# EAGLE design TinyTX_boost_converter (EAGLE 6.5.0)
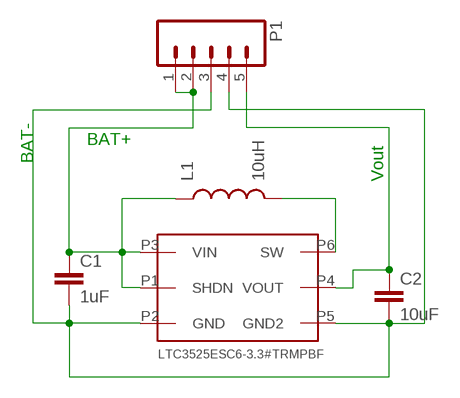
[diagram p0: schematic, sheet 1]

## Parts
C1  1uF  1.0UF-16V-10%(0603)  [0603-CAP]
C2  10uF  10UF-6.3V-20%(0603)  [0603-CAP]
L1  10uH  INDUCTOR1210  [1210]
P1  M05PTH  [1X05]
U1  LTC3525  [6-LEAD-SC70]

## Nets
GND: C1.2 C2.2 P1.3 P1.4 U1.P2(GND) U1.P5(GND2)
P6: L1.2 U1.P6(SW)
VCC: C2.1 P1.5 U1.P4(VOUT)
VIN: C1.1 L1.1 P1.1 P1.2 U1.P1(SHDN) U1.P3(VIN)

## Notes on the sheet
- BAT+ | Vout
- BAT-
- LTC3525ESC6-3.3#TRMPBF

## Library data of the parts
C1 = SparkFun-Capacitors:1.0UF-16V-10%(0603): CAP-00868; PROD_ID: CAP-00868; VALUE: 1.0uF
C2 = SparkFun-Capacitors:10UF-6.3V-20%(0603): CAP-11015; PROD_ID: CAP-11015
L1 = SparkFun:INDUCTOR: Inductors Basic Inductor/Choke - 0603 and 1206. Footprints are not proven and vary greatly between part numbers.
P1 = SparkFun:M05: Header 5 Standard 5-pin 0.1" header. Use with straight break away headers (SKU : PRT-00116), right angle break away headers (PRT-00553), swiss pins (PRT-00743), machine pins (PRT-00117), and female headers (PRT-00115). Molex polarized connector foot print use with SKU : PRT-08230 with associated crimp pins and housings.
U1 = TSlib:LTC3525

## Board
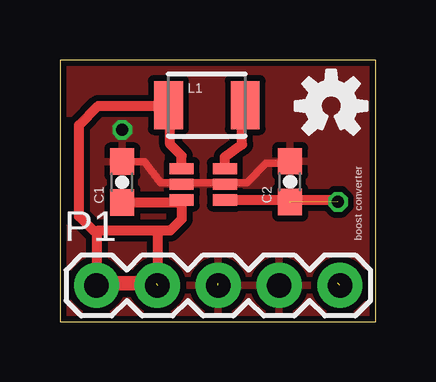
[diagram p1: board, top side]
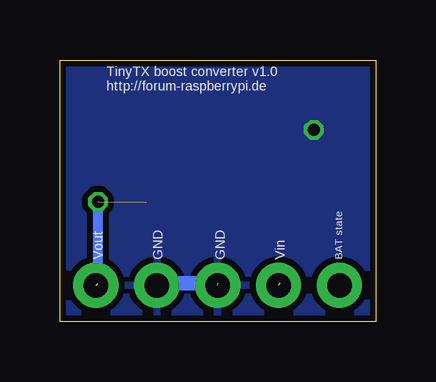
[diagram p2: board, bottom side, seen from below]

Size 13.19 x 10.91 mm. Coordinates in mm from the lower left corner, seen from the top.
Outline: 0,0 13.19,0 13.19,10.91 0,10.91 0,0
Copper layers (1*16): Top 0.035mm / dielectric 1.5mm / Bottom 0.035mm
Design rules "default *": minimum track width 6mil, minimum drill 12mil, track to track 6mil, track to pad 6mil, pad to pad 6mil, via to via 6mil, smd to smd 0mil, copper to edge 10mil, drill to drill 10mil, minimum pad ring 10mil, minimum via ring 6mil, stop-mask expansion 2mil, vias tented up to drill 100mil, thermal gap 10mil

### Footprints (pad centres in the part's own frame; a part is rotated, then mirrored left to right if it is on the bottom)
0603-CAP = smd 1.1 x 1: 1 -0.85,0; 2 0.85,0
1210 = smd 1.2 x 2: 1 -1.6,0; 2 1.6,0
1X05 = drill 1.016 pad 1.88: 1 0,0; 2 2.54,0; 3 5.08,0; 4 7.62,0; 5 10.16,0
6-LEAD-SC70 = smd 0.47 x 1: P1 -0.65,0; P2 0,0; P3 0.65,0; P4 0.65,1.8; P5 0,1.8; P6 -0.65,1.8

### Placement (x,y rotation side)
C1  2.59,5.83 90 top
C2  9.6,5.84 90 top
L1  6.13,9.04 0 top
P1  1.52,1.52 0 top
U1  5.08,5.73 270 top
U$1  [OSHW-LOGO-S]  11.32,9 0 top

### Tracks (layer width: path | path; a pad name or v marks a point on that pad's centre or on a via)
GND  (via drill 0.5)  (1 unrouted)
  Top 0.305: C1.2 3.52,6.68 4.2,5.8 7.8,5.8 8.6,6.6 9.51,6.6 C2.2
  Bottom 0.61: 9.2,1.6 6.6,1.6
  other vias: 2.6,8
  pour Top (isolate 0.254): 0,10.92 0,0 13.22,0 13.22,10.92
  pour Bottom (isolate 0.254): 0,10.92 0,0 13.22,0 13.22,10.92
P6
  Top 0.305: 7.6,8.91 L1.2
  Top 0.406: U1.P6 6.88,6.88 7.6,7.4 7.6,8.91
VCC  (via drill 0.5)  (2 unrouted)
  Top 0.305: 9.51,5.08 C2.1
  Top 0.406: U1.P4 11.6,5.08 v11.6,5
  Bottom 0.406: 11.6,1.6 v11.6,5
VIN  (1 unrouted)
  Top 0.305: 4.6,8.96 L1.1 4.49,9 | 1.4,3.8 1.6,3.8 1.52,3.72 | 4.06,3.66 4.2,3.8 | 4.97,4.98 U1.P3
  Top 0.406: U1.P1 5.08,6.92 4.6,7.4 4.6,8.96 | U1.P3 5.08,4.28 4.6,3.8 4.2,3.8 1.6,3.8 | 1.4,3.8 0.8,4.4 0.8,8.2 1.6,9 4.49,9 | C1.1 4.97,4.98 | 1.52,3.72 P1.1 | 4.06,3.66 P1.2
  Top 0.61: 1.6,1.6 4,1.6

### Text on the board
_tsilk: boost converter
_bsilk: TinyTX boost converter v1.0 / http://forum-raspberrypi.de | BAT state | Vin | GND | GND | Vout